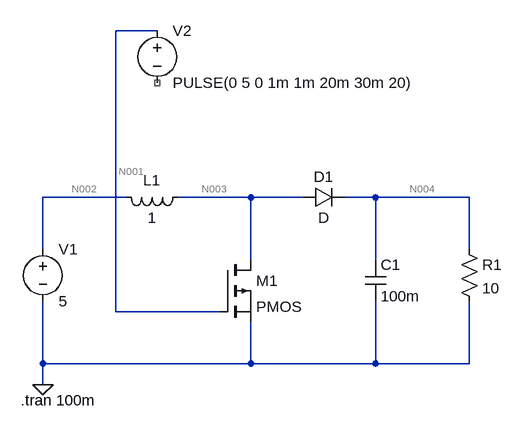
[diagram p0: schematic step-up.asc]
step-up.asc, the LTspice schematic file:
Version 4
SHEET 1 1060 680
WIRE -240 -304 -304 -304
WIRE -288 -48 -416 -48
WIRE -96 -48 -208 -48
WIRE -16 -48 -96 -48
WIRE 96 -48 48 -48
WIRE 240 -48 96 -48
WIRE -416 32 -416 -48
WIRE 240 32 240 -48
WIRE -96 48 -96 -48
WIRE 96 48 96 -48
WIRE -304 128 -304 -304
WIRE -144 128 -304 128
WIRE -416 208 -416 112
WIRE -96 208 -96 144
WIRE -96 208 -416 208
WIRE 96 208 96 112
WIRE 96 208 -96 208
WIRE 240 208 240 112
WIRE 240 208 96 208
WIRE -416 240 -416 208
FLAG -416 240 0
SYMBOL voltage -416 16 R0
WINDOW 123 0 0 Left 0
WINDOW 39 0 0 Left 0
SYMATTR InstName V1
SYMATTR Value 5
SYMBOL ind -192 -64 R90
WINDOW 0 5 56 VBottom 2
WINDOW 3 32 56 VTop 2
SYMATTR InstName L1
SYMATTR Value 1
SYMBOL cap 80 48 R0
SYMATTR InstName C1
SYMATTR Value 100m
SYMBOL res 224 16 R0
SYMATTR InstName R1
SYMATTR Value 10
SYMBOL pmos -144 48 R0
SYMATTR InstName M1
SYMBOL diode -16 -32 R270
WINDOW 0 32 32 VTop 2
WINDOW 3 0 32 VBottom 2
SYMATTR InstName D1
SYMBOL voltage -240 -320 R0
WINDOW 123 0 0 Left 0
WINDOW 39 0 0 Left 0
SYMATTR InstName V2
SYMATTR Value PULSE(0 5 0 1m 1m 20m 30m 20)
TEXT -450 264 Left 2 !.tran 100m

The netlist it stands for:
* step-up.asc
V1 N002 0 5
L1 N003 N002 1
C1 N004 0 100m
R1 N004 0 10
M1 N003 N001 0 0 PMOS
D1 N003 N004 D
V2 N001 NC_01 PULSE(0 5 0 1m 1m 20m 30m 20)
.model D D
.lib standard.dio
.model NMOS NMOS
.model PMOS PMOS
.lib standard.mos
.tran 100m
.backanno
.end

* Results of the author's LTspice run, read from the files saved beside the schematic
* Operating Point, zero values left out:
*   V(n002) = 5 V
*   V(n003) = 1.048 V
*   V(n004) = 304.5 mV
*   Id(M1) = 3.952 kA
*   Ib(M1) = -3.952 kA
*   Is(M1) = -10.98 µA
*   I(D1) = 30.45 mA
*   I(L1) = -3.952 kA
*   I(R1) = 30.45 mA
*   I(V1) = -3.952 kA
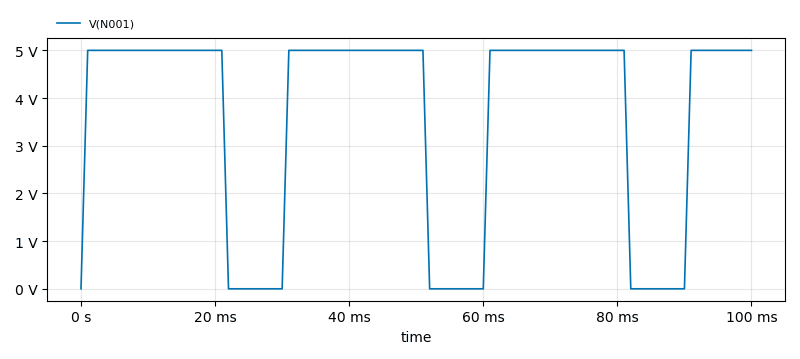
[diagram p1: Transient Analysis of step-up.asc, plotted from the saved traces]
* Transient Analysis, 1 run:
*   V(N001): min 0 V, max 5 V, average 3.625 V, rms 4.233 V, last 5 V